# Altium schematic sheet USB_TO_TTL.SchDoc
size A4; SheetNumber: 3; SheetTotal: 5
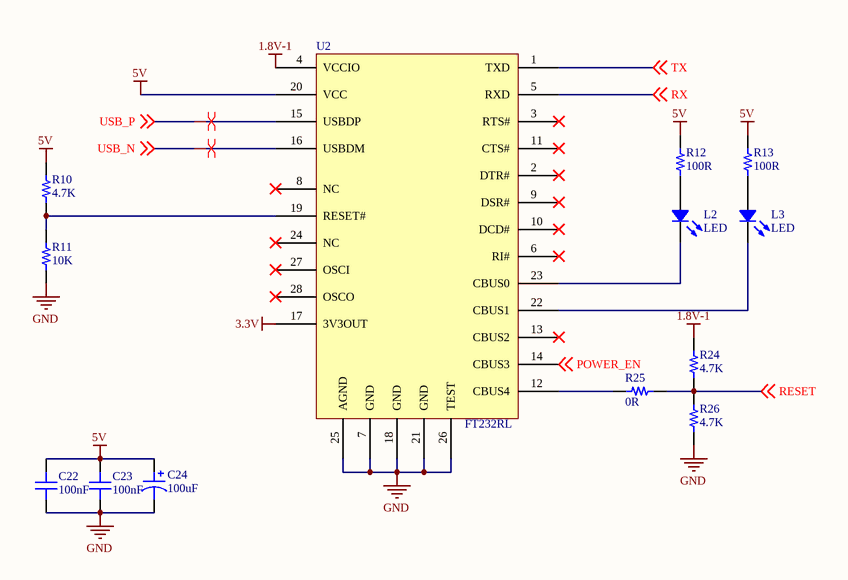
[diagram p0: USB_TO_TTL.SchDoc]

## Parts
C22  100nF  [CAP-SMD-0402]
C23  100nF  [CAP-SMD-0402]
C24  100uF  [CAP-TAN-CASE-B]
L2  LED  [LED-SMD-0805]
L3  LED  [LED-SMD-0805]
R10  4.7K  [RES-SMD-0402]
R11  10K  [RES-SMD-0402]
R12  100R  [RES-SMD-0402]
R13  100R  [RES-SMD-0402]
R24  4.7K  [RES-SMD-0402]
R25  0R  [RES-SMD-0402]
R26  4.7K  [RES-SMD-0402]
U2  FT232RL  [SSOP]

## Nets
1.8V-1: R24.2 U2.4(VCCIO)
3.3V: U2.17(3V3OUT)
5V: C22.2 C23.2 C24.1 R10.2 R12.2 R13.2 U2.20(VCC)
GND: C22.1 C23.1 C24.2 R11.1 R26.1 U2.7(GND) U2.18(GND) U2.21(GND) U2.25(AGND) U2.26(TEST)
POWER_EN: U2.14(CBUS3) ; off-sheet POWER_EN
RESET: R24.1 R25.1 R26.2 ; off-sheet RESET
RX: U2.5(RXD) ; off-sheet RX
TX: U2.1(TXD) ; off-sheet TX
USB_N: U2.16(USBDM) ; off-sheet USB_N
USB_P: U2.15(USBDP) ; off-sheet USB_P
NetL2_1: L2.1 R12.1
NetL2_2: L2.2 U2.23(CBUS0)
NetL3_1: L3.1 R13.1
NetL3_2: L3.2 U2.22(CBUS1)
NetR10_1: R10.1 R11.2 U2.19(RESET#)
NetR25_2: R25.2 U2.12(CBUS4)

Not connected (* = marked no-connect by the designer): U2 2(DTR#)* 3(RTS#)* 6(RI#)* 8(NC)* 9(DSR#)* 10(DCD#)* 11(CTS#)* 13(CBUS2)* 24(NC)* 27(OSCI)* 28(OSCO)*

## Layout directives
differential pair: USB_N, USB_P

## Library data of the parts
C22 C23 = CAP
C24 = POLARIZED CAP
R10-R13 R24-R26 = RES